# EAGLE design SAMD21 (EAGLE 9.1.3)

## Sheet 1 of 2
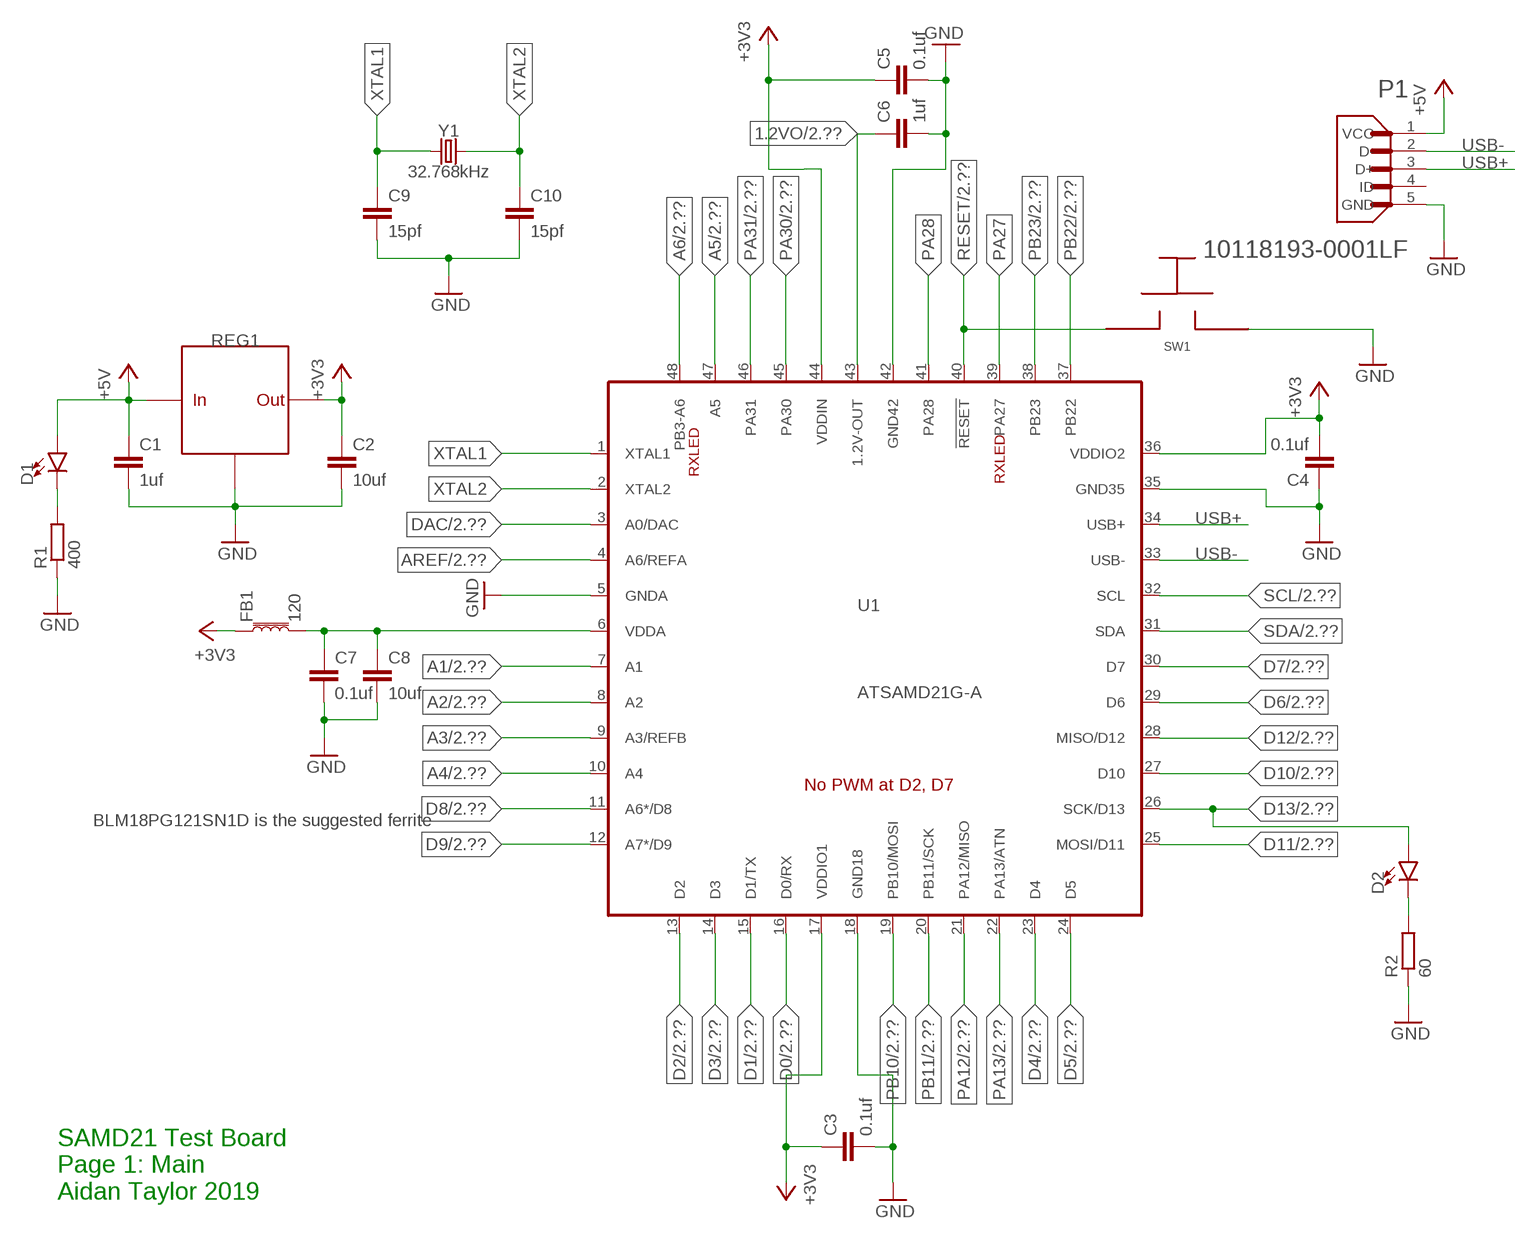
[diagram p0: schematic, sheet 1]

### Parts
C1  1uf  C-EUC0805  [C0805]
C2  10uf  C-EUC0805  [C0805]
C3  0.1uf  C-EUC0603  [C0603]
C4  0.1uf  C-EUC0603  [C0603]
C5  0.1uf  C-EUC0603  [C0603]
C6  1uf  C-EUC0805  [C0805]
C7  0.1uf  C-EUC0603  [C0603]
C8  10uf  C-EUC0805  [C0805]
C9  15pf  C-EUC0603  [C0603]
C10  15pf  C-EUC0603  [C0603]
D1  LED0603  [LED-0603]
D2  LED0603  [LED-0603]
FB1  120  FERRITE_BEAD-0603  [0603]
P1  10118193-0001LF  [FCI_10118193-0001LF]
R1  400  R-EU_R0603  [R0603]
R2  60  R-EU_R0603  [R0603]
REG1  TLV1117LV33DCYT  [SOT223]
SW1  KXT3_LOWPROFILE_SMDSWITCH  [KXT3_SMD_SWITCH]
U1  ATSAMD21G-A  [TQFP-48]
Y1  32.768kHz  CRYSTAL-32.768KHZSMD-3.2X1.5  [CRYSTAL-SMD-3.2X1.5MM]

### Nets
1.2VO: C6.1 U1.43(1.2V-OUT) ; also sheet 2
+3V3: C2.1 C3.1 C4.2 C5.1 FB1.1 REG1.2(VOUT) REG1.4(VOUT) U1.17(VDDIO1) U1.36(VDDIO2) U1.44(VDDIN) ; also sheet 2
+5V: C1.1 D1.A P1.1(VCC) REG1.3(VIN) ; also sheet 2
A1: U1.7(A1) ; also sheet 2
A2: U1.8(A2) ; also sheet 2
A3: U1.9(A3/REFB) ; also sheet 2
A4: U1.10(A4) ; also sheet 2
A5: U1.47(A5) ; also sheet 2
A6: U1.48(PB3-A6) ; also sheet 2
AREF: U1.4(A6/REFA) ; also sheet 2
D0: U1.16(D0/RX) ; also sheet 2
D1: U1.15(D1/TX) ; also sheet 2
D2: U1.13(D2) ; also sheet 2
D3: U1.14(D3) ; also sheet 2
D4: U1.23(D4) ; also sheet 2
D5: U1.24(D5) ; also sheet 2
D6: U1.29(D6) ; also sheet 2
D7: U1.30(D7) ; also sheet 2
D8: U1.11(A6*/D8) ; also sheet 2
D9: U1.12(A7*/D9) ; also sheet 2
D10: U1.27(D10) ; also sheet 2
D11: U1.25(MOSI/D11) ; also sheet 2
D12: U1.28(MISO/D12) ; also sheet 2
D13: D2.A U1.26(SCK/D13) ; also sheet 2
DAC: U1.3(A0/DAC) ; also sheet 2
GND: C1.2 C2.2 C3.2 C4.1 C5.2 C6.2 C7.2 C8.2 C9.2 C10.2 P1.5(GND) R1.1 R2.1 REG1.1(GND) SW1.P$2 U1.5(GNDA) U1.18(GND18) U1.35(GND35) U1.42(GND42) ; also sheet 2
N$1: C7.1 C8.1 FB1.2 U1.6(VDDA)
N$2: D1.C R1.2
N$3: D2.C R2.2
PA12: U1.21(PA12/MISO) ; also sheet 2
PA13: U1.22(PA13/ATN) ; also sheet 2
PA27: U1.39(PA27)
PA28: U1.41(PA28)
PA30: U1.45(PA30) ; also sheet 2
PA31: U1.46(PA31) ; also sheet 2
PB10: U1.19(PB10/MOSI) ; also sheet 2
PB11: U1.20(PB11/SCK) ; also sheet 2
PB22: U1.37(PB22) ; also sheet 2
PB23: U1.38(PB23) ; also sheet 2
RESET: SW1.P$1 U1.40(!RESET!) ; also sheet 2
SCL: U1.32(SCL) ; also sheet 2
SDA: U1.31(SDA) ; also sheet 2
USB+: P1.3(D+) U1.34(USB+)
USB-: P1.2(D-) U1.33(USB-)
XTAL1: C9.1 U1.1(XTAL1) Y1.P$1
XTAL2: C10.1 U1.2(XTAL2) Y1.P$2
Unconnected: P1.4(ID)

### Notes on the sheet
- BLM18PG121SN1D is the suggested ferrite
- SAMD21 Test Board
  Page 1: Main
  Aidan Taylor 2019

## Sheet 2 of 2
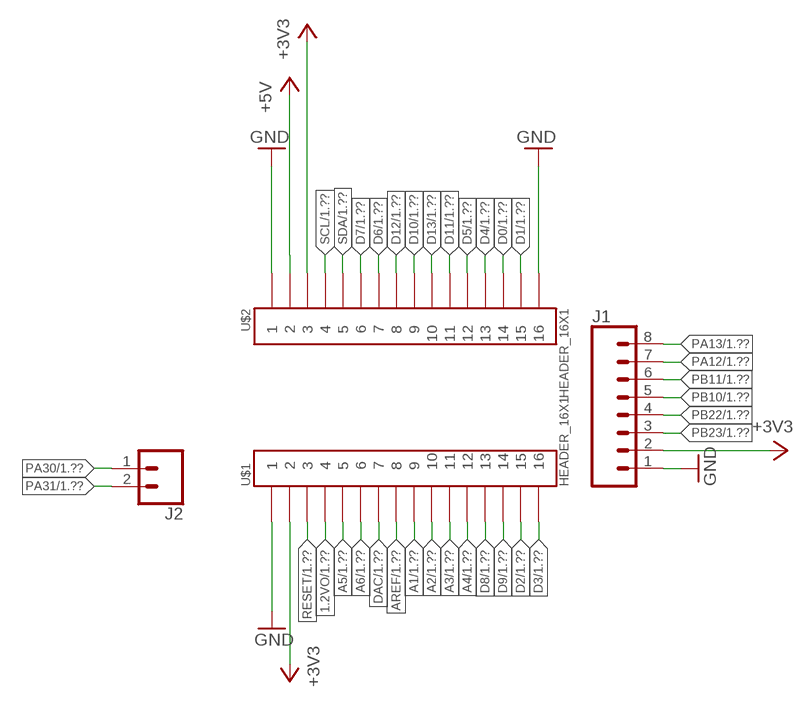
[diagram p1: schematic, sheet 2]

### Parts
J1  CONN_08"  [1X08]
J2  CONN_02  [1X02]
U$1  HEADER_16X1  [HDRV16W64P254_1X16_4064X254X900B_NO_SILK]
U$2  HEADER_16X1  [HDRV16W64P254_1X16_4064X254X900B_NO_SILK]

### Nets
1.2VO: U$1.P$4 ; also sheet 1
+3V3: J1.2 U$1.P$2 U$2.P$3 ; also sheet 1
+5V: U$2.P$2 ; also sheet 1
A1: U$1.P$9 ; also sheet 1
A2: U$1.P$10 ; also sheet 1
A3: U$1.P$11 ; also sheet 1
A4: U$1.P$12 ; also sheet 1
A5: U$1.P$5 ; also sheet 1
A6: U$1.P$6 ; also sheet 1
AREF: U$1.P$8 ; also sheet 1
D0: U$2.P$14 ; also sheet 1
D1: U$2.P$15 ; also sheet 1
D2: U$1.P$15 ; also sheet 1
D3: U$1.P$16 ; also sheet 1
D4: U$2.P$13 ; also sheet 1
D5: U$2.P$12 ; also sheet 1
D6: U$2.P$7 ; also sheet 1
D7: U$2.P$6 ; also sheet 1
D8: U$1.P$13 ; also sheet 1
D9: U$1.P$14 ; also sheet 1
D10: U$2.P$9 ; also sheet 1
D11: U$2.P$11 ; also sheet 1
D12: U$2.P$8 ; also sheet 1
D13: U$2.P$10 ; also sheet 1
DAC: U$1.P$7 ; also sheet 1
GND: J1.1 U$1.P$1 U$2.P$1 U$2.P$16 ; also sheet 1
PA12: J1.7 ; also sheet 1
PA13: J1.8 ; also sheet 1
PA30: J2.1 ; also sheet 1
PA31: J2.2 ; also sheet 1
PB10: J1.5 ; also sheet 1
PB11: J1.6 ; also sheet 1
PB22: J1.4 ; also sheet 1
PB23: J1.3 ; also sheet 1
RESET: U$1.P$3 ; also sheet 1
SCL: U$2.P$4 ; also sheet 1
SDA: U$2.P$5 ; also sheet 1

## Library data of the parts
C1-C10 = rcl:C-EU: CAPACITOR, European symbol; SPICEPREFIX: C
D1 D2 = SparkFun-LED:LED: LED (Generic) Standard schematic elements and footprints for 5mm, 3mm, 1206, and 0603 sized LEDs. Generic LEDs with no color specified.
FB1 = SparkFun-Coils:FERRITE_BEAD: Ferrite Bead (blocks, cores, rings, chokes, etc.) Inductor with layers of ferrite used to suppress high frequencies. Often used to isolate high frequency noise. SparkFun Products: IOIO-OTG - V2.2 <https://www.sparkfun.com/products/13613> SparkFun SAMD21 Mini Breakout <https://www.sparkfun.com/products/13664> SparkFun 6 Degrees of Freedom Breakout - LSM6DS3 <https://www.sparkfun.com/products/13339> SparkFun SAMD21 Dev Breakout <https://www.sparkfun.com/products/13672>; PROD_ID: NDUC-13805; VALUE: 30Ω/1.8A
J1 = SparkFun-Connectors:CONN_08: Multi connection point. Often used as Generic Header-pin footprint for 0.1 inch spaced/style header connections On any of the 0.1 inch spaced packages, you can populate with these: Break Away Headers - Straight <https://www.sparkfun.com/products/116> (PRT-00116) Break Away Male Headers - Right Angle <https://www.sparkfun.com/products/553> (PRT-00553) Female Headers <https://www.sparkfun.com/products/115> (PRT-00115) Break Away Headers - Machine Pin <https://www.sparkfun.com/products/117> (PRT-00117) Break Away Female Headers - Swiss Machine Pin <https://www.sparkfun.com/products/743> (PRT-00743) Arduino Stackable Header - 8 Pin <https://www.sparkfun.com/products/9279> (PRT-09279) For SCREWTERMINALS and SPRING TERMINALS visit here: Screw Terimnals on SparkFun.com <https://www.sparkfun.com/search/results?term=Screw+Terminals> (5mm/3.5mm/2.54mm spacing) This device is also useful as a general connection point to wire up your design to another part of your project. Our various solder wires solder well into these plated through hole pads. Hook-Up Wire - Assortment (Stranded, 22 AWG) <https://www.sparkfun.com/products/11375> (PRT-11375) Hook-Up Wire - Assortment (Solid Core, 22 AWG) <https://www.sparkfun.com/products/11367> (PRT-11367) View the entire wire category on our website here <https://www.sparkfun.com/categories/141> Special notes: Molex polarized connector foot print use with SKU : PRT-08231 with associated crimp pins and housings. 1MM SMD Version SKU: PRT-10208 NOTES ON THE VARIANTS LOCK and LOCK_LONGPADS... This footprint was designed to help hold the alignment of a through-hole component (i.e. 6-pin header) while soldering it into place. You may notice that each hole has been shifted either up or down by 0.005 of an inch from it's more standard position (which is a perfectly straight line). This slight alteration caused the pins (the squares in the middle) to touch the edges of the holes. Because they are alternating, it causes a "brace" to hold the component in place. 0.005 has proven to be the perfect amount of "off-center" position when using our standard breakaway headers. Although looks a little odd when you look at the bare footprint, once you have a header in there, the alteration is very hard to notice. Also,if you push a header all the way into place, it is covered up entirely on the bottom side.; PROD_ID: CONN-08438
J2 = SparkFun-Connectors:CONN_02: Multi connection point. Often used as Generic Header-pin footprint for 0.1 inch spaced/style header connections On any of the 0.1 inch spaced packages, you can populate with these: Break Away Headers - Straight <https://www.sparkfun.com/products/116> (PRT-00116) Break Away Male Headers - Right Angle <https://www.sparkfun.com/products/553> (PRT-00553) Female Headers <https://www.sparkfun.com/products/115> (PRT-00115) Break Away Headers - Machine Pin <https://www.sparkfun.com/products/117> (PRT-00117) Break Away Female Headers - Swiss Machine Pin <https://www.sparkfun.com/products/743> (PRT-00743) For SCREWTERMINALS and SPRING TERMINALS visit here: Screw Terimnals on SparkFun.com <https://www.sparkfun.com/search/results?term=Screw+Terminals> (5mm/3.5mm/2.54mm spacing) This device is also useful as a general connection point to wire up your design to another part of your project. Our various solder wires solder well into these plated through hole pads. Hook-Up Wire - Assortment (Stranded, 22 AWG) <https://www.sparkfun.com/products/11375> (PRT-11375) Hook-Up Wire - Assortment (Solid Core, 22 AWG) <https://www.sparkfun.com/products/11367> (PRT-11367) View the entire wire category on our website here <https://www.sparkfun.com/categories/141> Special notes: Molex polarized connector foot print use with: PRT-08233 with associated crimp pins and housings. 2.54_SCREWTERM for use with PRT-10571. 3.5mm Screw Terminal footprints for PRT-08084 5mm Screw Terminal footprints for use with PRT-08432
P1 = 10118193-0001LF:10118193-0001LF: Micro USB B Type Receptacle; AVAILABILITY: Unavailable; DESCRIPTION: Conn Micro USB Type B RCP 5 POS 0.65mm Solder RA SMD 5 Terminal 1 Port T/R; MF: Amphenol FCI; MP: 10118193-0001LF; PACKAGE: None; PRICE: None
R1 R2 = rcl:R-EU_: RESISTOR, European symbol; SPICEPREFIX: R
REG1 = ElectricNoodleBox2018:TLV1117LV33DCYT
SW1 = ElectricNoodleBox2018:KXT3_LOWPROFILE_SMDSWITCH
U1 = Albert-Arduino:ATSAMD21G: Atmel SAMD21G SMART ARM-Based Microcontroller The Atmel ® | SMART  SAM D21 is a series of low-power microcontrollers using the 32-bit ARM ® Cortex ® -M0+ processor, and ranging from 32- to 64-pins with up to 256KB Flash and 32KB of SRAM. The SAM D21 devices operate at a maximum frequency of 48MHz and reach 2.46 CoreMark/MHz. They are designed for simple and intuitive migration with identical peripheral modules, hex compatible code, identical linear address map and pin compatible migration paths between all devices in the product series. All devices include intelligent and flexible peripherals, Atmel Event System for inter-peripheral signaling, and support for capacitive touch button, slider and wheel user interfaces.; PROD_ID: IC-13064
U$1 U$2 = Nordic_misc:HEADER_16X1
Y1 = SparkFun-Clocks:CRYSTAL-32.768KHZ: 32.768kHz Crystal Frequency: 32.768kHz Frequency Stability: ±20ppm Load Capacitance: 12.5pF (PTH-2X6 & SMD-3.2X1.5), 6pF (SMD-2X6) SparkFun Products: SparkFun BigTime Watch Kit <https://www.sparkfun.com/products/11734> SparkFun nRF52832 Breakout <https://www.sparkfun.com/products/13990> SparkFun Real Time Clock Module <https://www.sparkfun.com/products/12708>; PROD_ID: XTAL-13062

## Board
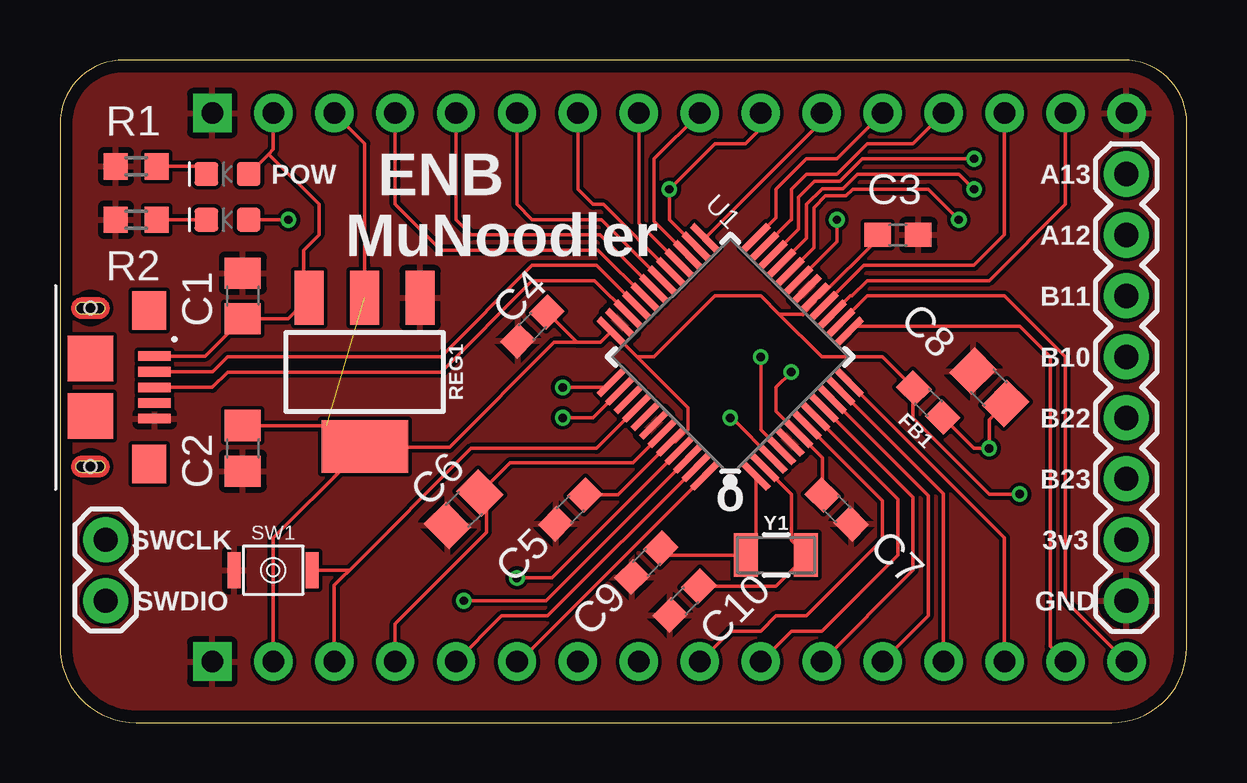
[diagram p2: board, top side]
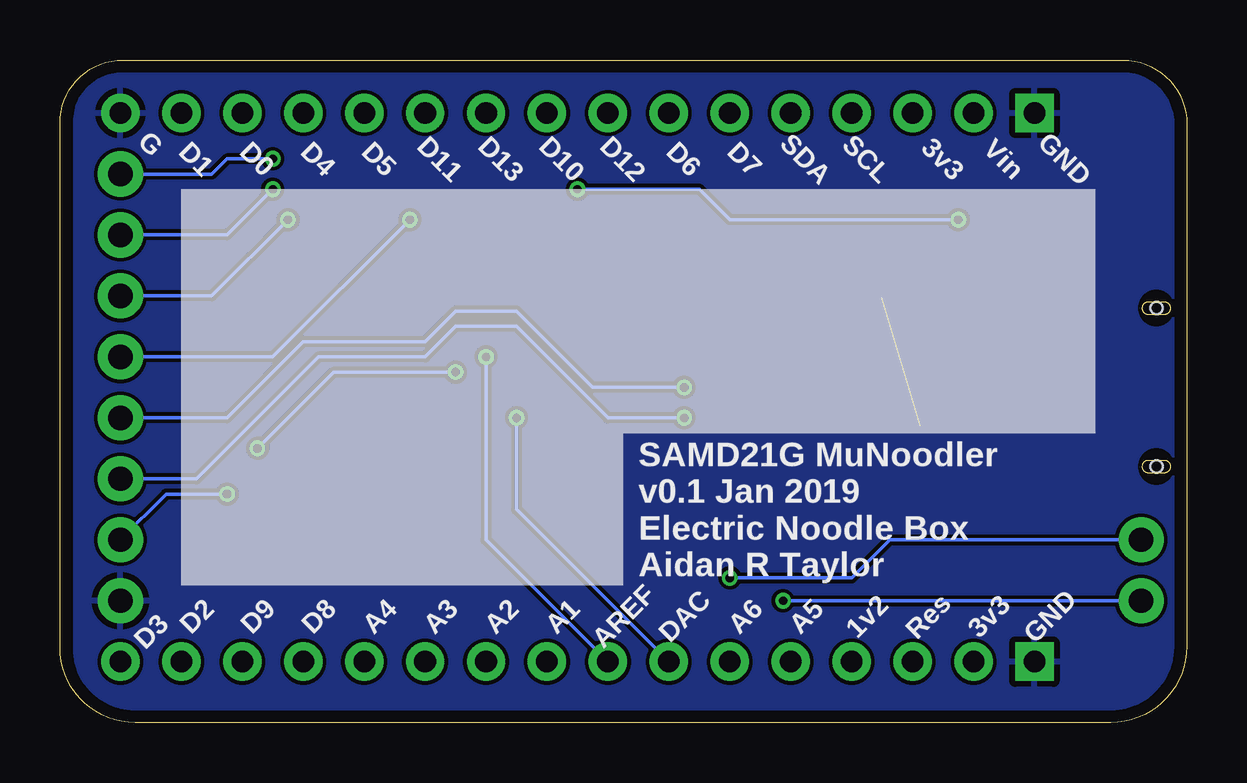
[diagram p3: board, bottom side, seen from below]

Size 46.97 x 27.61 mm. Coordinates in mm from the lower left corner, seen from the top.
Outline: 0,24.94 0,3.17 arc90 3.17,0 43.84,0 arc90 46.97,3.13 46.97,24.98 arc90 44.34,27.61 2.67,27.61 arc90 0,24.94
Copper layers (1*16): Top 0.035mm / dielectric 1.6mm / Bottom 0.035mm
Design rules "Elecrow_2-layer_PCB_eagle_rule": minimum track width 6mil, minimum drill 12mil, track to track 6mil, track to pad 6mil, pad to pad 6mil, via to via 8mil, smd to smd 0mil, copper to edge 20mil, drill to drill 10mil, minimum pad ring 6mil, minimum via ring 6mil, stop-mask expansion 0mil, vias tented up to drill 100mil, thermal gap 10mil

### Footprints (pad centres in the part's own frame; a part is rotated, then mirrored left to right if it is on the bottom)
C0805 = smd 1.3 x 1.5: 1 -0.95,0; 2 0.95,0
C0603 = smd 1.1 x 1: 1 -0.85,0; 2 0.85,0
LED-0603 = smd 1 x 1: A -0.877,0; C 0.877,0
0603 = smd 1.1 x 1: 1 -0.85,0; 2 0.85,0
1X08 = drill 1.016 pad 1.88: 1 0,0; 2 2.54,0; 3 5.08,0; 4 7.62,0; 5 10.16,0; 6 12.7,0; 7 15.24,0; 8 17.78,0
1X02 = drill 1.016 pad 1.88: 1 0,0; 2 2.54,0
FCI_10118193-0001LF = smd 0.4 x 1.35: 1 -1.3,2.675; 2 -0.65,2.675; 3 0,2.675; 4 0.65,2.675; 5 1.3,2.675 | smd 1.6 x 1.4: P1 -3.2,2.45; P2 3.2,2.45 | smd 1.9 x 1.9: P3 1.2,0; P4 -1.2,0 | hole 0.5: -3.3,0; 3.3,0
R0603 = smd 1 x 1.1: 1 -0.85,0; 2 0.85,0
SOT223 = smd 1.219 x 2.235: 1 -2.311,-3.099; 2 0,-3.099; 3 2.311,-3.099 | smd 3.6 x 2.2: 4 0,3.099
KXT3_SMD_SWITCH = smd 0.55 x 1.5: P$1 -1.625,0; P$2 1.625,0
TQFP-48 = smd 1.5 x 0.28: 1 -4.25,2.75; 2 -4.25,2.25; 3 -4.25,1.75; 4 -4.25,1.25; 5 -4.25,0.75; 6 -4.25,0.25; 7 -4.25,-0.25; 8 -4.25,-0.75; 9 -4.25,-1.25; 10 -4.25,-1.75; 11 -4.25,-2.25; 12 -4.25,-2.75; 25 4.25,-2.75; 26 4.25,-2.25; 27 4.25,-1.75; 28 4.25,-1.25; 29 4.25,-0.75; 30 4.25,-0.25; 31 4.25,0.25; 32 4.25,0.75; 33 4.25,1.25; 34 4.25,1.75; 35 4.25,2.25; 36 4.25,2.75 | smd 0.28 x 1.5: 13 -2.75,-4.25; 14 -2.25,-4.25; 15 -1.75,-4.25; 16 -1.25,-4.25; 17 -0.75,-4.25; 18 -0.25,-4.25; 19 0.25,-4.25; 20 0.75,-4.25; 21 1.25,-4.25; 22 1.75,-4.25; 23 2.25,-4.25; 24 2.75,-4.25; 37 2.75,4.25; 38 2.25,4.25; 39 1.75,4.25; 40 1.25,4.25; 41 0.75,4.25; 42 0.25,4.25; 43 -0.25,4.25; 44 -0.75,4.25; 45 -1.25,4.25; 46 -1.75,4.25; 47 -2.25,4.25; 48 -2.75,4.25
HDRV16W64P254_1X16_4064X254X900B_NO_SILK = drill 0.9 pad 1.6 square: P$1 -19.05,0 | drill 0.9 pad 1.6: P$2 -16.51,0; P$3 -13.97,0; P$4 -11.43,0; P$5 -8.89,0; P$6 -6.35,0; P$7 -3.81,0; P$8 -1.27,0; P$9 1.27,0; P$10 3.81,0; P$11 6.35,0; P$12 8.89,0; P$13 11.43,0; P$14 13.97,0; P$15 16.51,0; P$16 19.05,0
CRYSTAL-SMD-3.2X1.5MM = smd 1 x 1.8: P$1 -1.25,0; P$2 1.25,0

### Placement (x,y rotation side)
C1  7.62,17.78 90 top
C2  7.62,11.43 270 top
C3  34.93,20.32 0 top
C4  19.68,16.51 45 top
C5  21.27,8.89 225 top
C6  16.83,8.89 225 top
C7  32.39,8.89 315 top
C8  38.73,13.97 135 top
C9  24.45,6.67 225 top
C10  26.04,5.08 225 top
D1  6.99,22.86 180 top
D2  6.99,20.95 180 top
FB1  36.2,13.34 315 top
J1  44.45,5.08 90 top
J2  1.91,7.62 270 top
P1  1.27,13.97 270 top
R1  3.17,23.18 0 top
R2  3.17,20.95 0 top
REG1  12.7,14.61 180 top
SW1  8.89,6.35 180 top
U1  27.94,15.24 135 top
U$1  25.4,2.54 0 top
U$2  25.4,25.4 0 top
Y1  29.84,6.99 0 top

### Tracks (layer width: path | path; a pad name or v marks a point on that pad's centre or on a via)
1.2VO
  Top 0.152: U1.43 23.88,10.83 18.77,10.83 C6.1 17.78,9.28 17.78,7.94 13.97,4.13 U$1.P$4
+3V3  (via drill 0.35)  (1 unrouted)
  Top 0.152: REG1.2 12.7,19.05 12.7,24.13 U$2.P$3 | REG1.4 12.66,11.47 | 12.66,11.47 12.34,11.15 | 12.34,11.15 12.03,10.83 | 12.03,10.83 11.43,10.24 | C2.1 11.12,12.38 12.34,11.15 | 24.05,15.24 U1.36 22.53,15.84 21.9,15.84 21.56,15.84 | 30.97,17 30.97,17.02 | 30.97,17.02 31.48,17.53 U1.17 31.66,17.71 34.11,20.16 C3.1 | 24.05,15.24 24.76,15.24 27.3,17.78 29.21,17.78 29.96,17.02 | 24.05,15.24 26.18,13.11 26.18,12.21 26.15,12.21 25.65,11.7 U1.44 23.25,9.49 C5.1 | 29.96,17.02 30.97,17.02 | 29.96,17.02 31.75,15.24 34.29,15.24 FB1.1 35.56,13.9 35.56,12.7 38.73,9.53 v40.01,9.53 | C4.2 21.56,15.84 | 12.7,11.43 12.66,11.47 | U$1.P$2 8.89,7.7 12.03,10.83 | 21.56,15.84 20.6,15.84 16.23,11.47 12.66,11.47
  Bottom 0.152: v40.01,9.53 42.55,9.53 J1.2
+5V
  Top 0.152: P1.1 6.06,15.27 C1.1 9.52,16.83 10.31,17.63 | 10.31,17.63 REG1.3 | 10.31,17.63 10.16,17.78 10.16,19.68 10.79,20.32 10.79,21.59 8.69,23.69 | U$2.P$2 8.89,24.13 | 8.89,24.13 8.89,23.89 | 8.69,23.69 D1.A | 8.89,24.13 8.89,23.89 | 8.89,23.89 8.69,23.69
A1
  Top 0.152: U1.7 34.29,9.24 34.29,7.62 31.11,4.45 29.84,4.45 29.21,3.81 27.94,3.81 U$1.P$9
A2
  Top 0.152: U1.8 34.93,9.32 34.93,6.99 31.75,3.81 30.48,3.81 U$1.P$10
A3
  Top 0.152: U1.9 35.56,9.39 35.56,6.35 U$1.P$11
A4
  Top 0.152: U1.10 36.2,9.46 36.2,4.45 U$1.P$12
A5
  Top 0.152: U1.47 20.33,4.45 18.41,4.45 U$1.P$5
A6
  Top 0.152: U1.48 19.13,2.54 U$1.P$6
AREF  (via drill 0.35)
  Top 0.152: U1.4 29.21,12.2 v29.21,15.24
  Bottom 0.152: v29.21,15.24 29.21,7.62 U$1.P$8
D0
  Top 0.152: U1.16 33.52,19.05 38.1,19.05 39.37,20.32 U$2.P$14
D1
  Top 0.152: U1.15 32.96,17.78 33.02,17.78 33.66,18.41 38.73,18.41 41.91,21.59 U$2.P$15
D2
  Top 0.152: U1.13 33.1,16.51 40.01,16.51 41.27,15.24 41.27,3.17 U$1.P$15
D3
  Top 0.152: U$1.P$16 41.91,5.08 41.91,15.24 39.37,17.78 33.66,17.78 U1.14
D4
  Top 0.152: U$2.P$13 35.56,24.13 33.66,24.13 32.39,22.86 31.11,22.86 30.48,22.23 30.48,20.95 30.47,20.95 U1.23
D5
  Top 0.152: U1.24 29.84,21.03 29.84,22.23 31.11,23.5 32.39,23.5 U$2.P$12
D6
  Top 0.152: U1.29 22.65,21.59 22.22,21.59 21.59,22.23 U$2.P$7
D7
  Top 0.152: U1.30 22.58,20.95 19.68,20.95 19.05,21.59 19.05,22.86 U$2.P$6
D8
  Top 0.152: U1.11 36.83,9.53 U$1.P$13
D9
  Top 0.152: U1.12 39.37,7.7 U$1.P$14
D10
  Top 0.152: U1.27 24.76,20.89 24.76,23.5 U$2.P$9
D11
  Top 0.152: U1.25 31.75,25.06 U$2.P$11
D12
  Top 0.152: U1.28 24.13,20.82 U$2.P$8
D13  (via drill 0.35)
  Top 0.152: U1.26 25.4,20.96 v25.4,22.23 27.3,24.13 28.57,24.13 29.21,24.77 U$2.P$10 | D2.A v9.53,20.95
  Bottom 0.152: v9.53,20.95 19.05,20.95 20.32,22.23 v25.4,22.23
DAC  (via drill 0.35)
  Top 0.152: U1.3 28,12.7 v27.94,12.7
  Bottom 0.152: v27.94,12.7 27.94,8.89 U$1.P$7
GND
  pour Top: -0.64,0 46.36,0 46.36,27.94 -0.64,27.94
  pour Bottom: -0.64,27.94 -0.64,0 46.36,0 46.36,27.94
N$1  (via drill 0.35)
  Top 0.152: C7.1 31.78,11.04 U1.6 29.84,12.98 29.84,13.97 v30.48,14.61 | C8.1 38.73,12.63 v38.73,11.43 38.1,11.43 FB1.2
  Bottom 0.152: v30.48,14.61 35.56,14.61 v38.73,11.43
N$2
  Top 0.152: R1.2 5.79,23.18 D1.C
N$3
  Top 0.152: D2.C R2.2
PA12  (via drill 0.35)
  Top 0.152: v38.1,22.23 37.47,22.86 33.25,22.86 32.64,22.25 31.77,22.25 31.11,21.59 31.11,20.18 U1.21
  Bottom 0.152: v38.1,22.23 40.01,20.32 J1.7
PA13  (via drill 0.35)
  Top 0.152: U1.22 30.79,20.56 30.79,21.89 31.44,22.55 32.51,22.55 33.45,23.5 v38.1,23.5
  Bottom 0.152: J1.8 40.64,22.86 40.01,23.5 v38.1,23.5
PA30  (via drill 0.35)
  Top 0.152: U1.45 20.5,6.03 v19.05,6.03
  Bottom 0.152: v19.05,6.03 13.97,6.03 12.38,7.62 J2.1
PA31  (via drill 0.35)
  Top 0.152: U1.46 20.25,5.08 v16.83,5.08
  Bottom 0.152: v16.83,5.08 J2.2
PB10  (via drill 0.35)
  Top 0.152: U1.19 32.39,20.04 v32.39,20.95
  Bottom 0.152: v32.39,20.95 38.1,15.24 J1.5
PB11  (via drill 0.35)
  Top 0.152: v37.47,20.95 36.2,22.23 33.04,22.23 32.76,21.95 31.9,21.95 31.42,21.46 31.42,19.78 U1.20
  Bottom 0.152: v37.47,20.95 40.64,17.78 J1.6
PB22  (via drill 0.35)
  Top 0.152: U1.37 22.78,13.97 v20.95,13.97
  Bottom 0.152: J1.4 40.01,12.7 36.83,15.88 31.75,15.88 30.48,17.14 27.94,17.14 24.76,13.97 v20.95,13.97
PB23  (via drill 0.35)
  Top 0.152: U1.38 22.22,12.71 22.22,12.7 v20.95,12.7
  Bottom 0.152: v20.95,12.7 24.13,12.7 27.94,16.51 30.48,16.51 31.75,15.24 36.2,15.24 41.27,10.16 J1.3
RESET
  Top 0.152: 12.06,6.35 17.14,11.43 22.36,11.43 U1.40 | U$1.P$3 11.43,5.71 11.75,6.03 12.06,6.35 | SW1.P$1 12.06,6.35
SCL
  Top 0.152: U$2.P$4 13.97,21.59 15.88,19.68 22.43,19.68 U1.32
SDA
  Top 0.152: U$2.P$5 16.51,20.95 17.14,20.32 22.51,20.32 U1.31
USB+
  Top 0.152: U1.34 22.29,18.41 19.68,18.41 15.88,14.61 6.99,14.61 6.35,13.97 P1.3
USB-
  Top 0.152: U1.33 22.36,19.05 19.68,19.05 15.88,15.24 6.99,15.24 6.37,14.62 P1.2
XTAL1
  Top 0.152: U1.1 29,7.39 Y1.P$1 25.33,6.99 C9.1
XTAL2
  Top 0.152: C10.1 29.84,5.68 31.09,6.93 Y1.P$2 30.48,7.6 30.48,9.52 U1.2

### Text on the board
tPlace: POW | ENB | A13 | MuNoodler | A12 | B11 | B10 | B22 | o | B23 | SWCLK | 3v3 | SWDIO | GND
bPlace: G | GND | Vin | 3v3 | SCL | SDA | D7 | D6 | D12 | D10 | D13 | D11 | D5 | D4 | D0 | D1 | SAMD21G MuNoodler / v0.1 Jan 2019 / Electric Noodle Box / Aidan R Taylor | GND | 3v3 | Res | 1v2 | A5 | A6 | DAC | AREF | A1 | A2 | A3 | A4 | D8 | D9 | D2 | D3